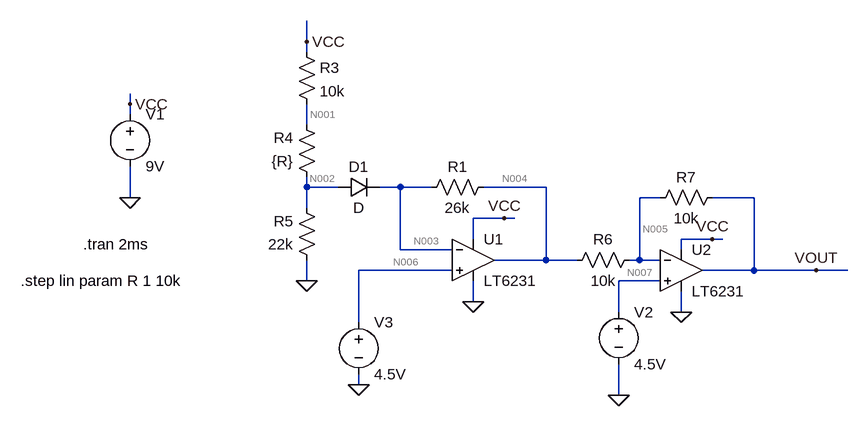
[diagram p0: schematic ExponentialSource.asc]
ExponentialSource.asc, the LTspice schematic file:
Version 4
SHEET 1 880 680
WIRE -336 16 -336 -16
WIRE -336 32 -336 16
WIRE -608 112 -608 96
WIRE -608 128 -608 112
WIRE -336 144 -336 112
WIRE -336 240 -336 224
WIRE -288 240 -336 240
WIRE -192 240 -224 240
WIRE -144 240 -192 240
WIRE 32 240 -64 240
WIRE -608 256 -608 208
WIRE 208 256 176 256
WIRE 352 256 288 256
WIRE -336 272 -336 240
WIRE -32 288 -80 288
WIRE -16 288 -32 288
WIRE 32 288 32 240
WIRE -80 320 -80 288
WIRE 288 320 240 320
WIRE 304 320 288 320
WIRE -192 336 -192 240
WIRE -112 336 -192 336
WIRE 240 336 240 320
WIRE 32 352 32 288
WIRE 32 352 -48 352
WIRE 80 352 32 352
WIRE 176 352 176 256
WIRE 176 352 160 352
WIRE 208 352 176 352
WIRE -112 368 -256 368
WIRE 352 368 352 256
WIRE 352 368 272 368
WIRE 448 368 352 368
WIRE 496 368 448 368
WIRE -336 384 -336 352
WIRE 208 384 144 384
WIRE -80 416 -80 384
WIRE 144 432 144 384
WIRE 240 432 240 400
WIRE -256 448 -256 368
WIRE -256 544 -256 528
WIRE 144 560 144 512
FLAG -608 256 0
FLAG -80 416 0
FLAG -256 544 0
FLAG -336 384 0
FLAG 240 432 0
FLAG -32 288 VCC
FLAG -608 112 VCC
FLAG 288 320 VCC
FLAG -336 16 VCC
FLAG 448 368 VOUT
FLAG 144 560 0
DATAFLAG 32 288 ""
SYMBOL voltage -608 112 R0
WINDOW 123 0 0 Left 2
WINDOW 39 0 0 Left 2
SYMATTR InstName V1
SYMATTR Value 9V
SYMBOL Opamps\\LT6231 -80 352 R0
SYMATTR InstName U1
SYMBOL res -48 224 R90
WINDOW 0 0 56 VBottom 2
WINDOW 3 32 56 VTop 2
SYMATTR InstName R1
SYMATTR Value 26k
SYMBOL voltage -256 432 R0
WINDOW 123 0 0 Left 2
WINDOW 39 0 0 Left 2
SYMATTR InstName V3
SYMATTR Value 4.5V
SYMBOL diode -288 256 R270
WINDOW 0 32 32 VTop 2
WINDOW 3 0 32 VBottom 2
SYMATTR InstName D1
SYMBOL res -320 240 R180
WINDOW 0 36 76 Left 2
WINDOW 3 36 40 Left 2
SYMATTR InstName R4
SYMATTR Value {R}
SYMBOL res -320 368 R180
WINDOW 0 36 76 Left 2
WINDOW 3 36 40 Left 2
SYMATTR InstName R5
SYMATTR Value 22k
SYMBOL res -352 16 R0
SYMATTR InstName R3
SYMATTR Value 10k
SYMBOL Opamps\\LT6231 240 368 R0
SYMATTR InstName U2
SYMBOL res 176 336 R90
WINDOW 0 0 56 VBottom 2
WINDOW 3 32 56 VTop 2
SYMATTR InstName R6
SYMATTR Value 10k
SYMBOL res 304 240 R90
WINDOW 0 0 56 VBottom 2
WINDOW 3 32 56 VTop 2
SYMATTR InstName R7
SYMATTR Value 10k
SYMBOL voltage 144 416 R0
WINDOW 123 0 0 Left 2
WINDOW 39 0 0 Left 2
SYMATTR InstName V2
SYMATTR Value 4.5V
TEXT -680 328 Left 2 !.tran 2ms
TEXT -776 384 Left 2 !.step lin param R 1 10k

The netlist it stands for:
* ExponentialSource.asc
V1 VCC 0 9V
XU1 N006 N003 N004 VCC 0 LT6231  ; pins In+ In- OUT V+ V-
R1 N004 N003 26k
V3 N006 0 4.5V
D1 N002 N003 D
R4 N002 N001 {R}
R5 0 N002 22k
R3 VCC N001 10k
XU2 N007 N005 VOUT VCC 0 LT6231  ; pins In+ In- OUT V+ V-
R6 N005 N004 10k
R7 VOUT N005 10k
V2 N007 0 4.5V
.model D D
.lib standard.dio
.tran 2ms
.step lin param R 1 10k
.lib LTC2.lib
.backanno
.end

* Results of the author's LTspice run, read from the files saved beside the schematic
* Operating Point (first step), zero values left out:
*   r = 1 
*   V(vcc) = 9 V
*   V(n003) = 4.5 V
*   V(n006) = 4.5 V
*   V(n004) = 545.7 mV
*   V(n002) = 5.107 V
*   V(n001) = 5.108 V
*   V(n005) = 4.5 V
*   V(n007) = 4.5 V
*   V(vout) = 8.504 V
*   I(D1) = 157.1 µA
*   I(R7) = 400.4 µA
*   I(R6) = 395.4 µA
*   I(R3) = 389.2 µA
*   I(R5) = -232.1 µA
*   I(R4) = -389.2 µA
*   I(R1) = -152.1 µA
*   I(V2) = -5.002 µA
*   I(V3) = -5.001 µA
*   I(V1) = -6.579 mA
*   Ix(u1:1) = 5.001 µA
*   Ix(u1:2) = 5.001 µA
*   Ix(u1:3) = 547.5 µA
*   Ix(u1:4) = 2.859 mA
*   Ix(u1:5) = -3.417 mA
*   Ix(u2:1) = 5.002 µA
*   Ix(u2:2) = 4.999 µA
*   Ix(u2:3) = -400.4 µA
*   Ix(u2:4) = 3.33 mA
*   Ix(u2:5) = -2.94 mA
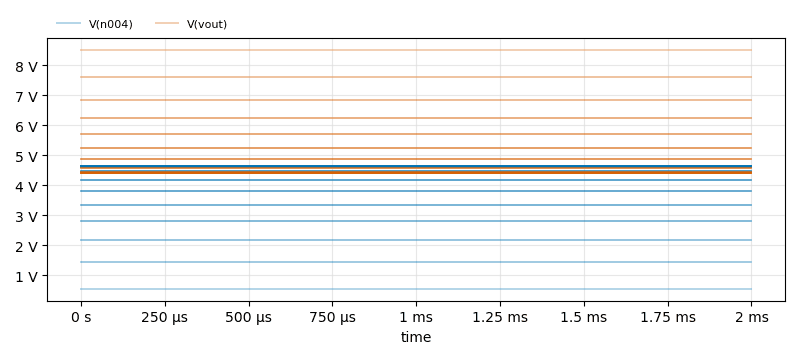
[diagram p1: Transient Analysis of ExponentialSource.asc, plotted from the saved traces]
* Transient Analysis, 21 runs:
*   V(n004) [run 1]: min 545.7 mV, max 545.7 mV, average 545.7 mV, rms 545.7 mV, last 545.7 mV
*   V(n004) [run 2]: 1.443 V at time=0 s, 1.443 V at time=0 s, min 1.443 V, max 1.443 V
*   V(n004) [run 3]: min 1.443 V, max 1.443 V, average 1.443 V, rms 1.443 V, last 1.443 V
*   V(n004) [run 4]: min 2.188 V, max 2.188 V, average 2.188 V, rms 2.188 V, last 2.188 V
*   V(n004) [run 5]: 2.814 V at time=0 s, 2.814 V at time=0 s, min 2.814 V, max 2.814 V
*   V(n004) [run 6]: min 2.814 V, max 2.814 V, average 2.814 V, rms 2.814 V, last 2.814 V
*   V(n004) [run 7]: min 3.346 V, max 3.346 V, average 3.346 V, rms 3.346 V, last 3.346 V
*   V(n004) [run 8]: 3.799 V at time=0 s, 3.799 V at time=0 s, min 3.799 V, max 3.799 V
*   V(vout) [run 1]: min 8.504 V, max 8.504 V, average 8.504 V, rms 8.504 V, last 8.504 V
*   V(vout) [run 2]: 7.607 V at time=0 s, 7.607 V at time=0 s, min 7.607 V, max 7.607 V
*   V(vout) [run 3]: min 7.607 V, max 7.607 V, average 7.607 V, rms 7.607 V, last 7.607 V
*   V(vout) [run 4]: min 6.862 V, max 6.862 V, average 6.862 V, rms 6.862 V, last 6.862 V
*   V(vout) [run 5]: 6.236 V at time=0 s, 6.236 V at time=0 s, min 6.236 V, max 6.236 V
*   V(vout) [run 6]: min 6.236 V, max 6.236 V, average 6.236 V, rms 6.236 V, last 6.236 V
*   V(vout) [run 7]: min 5.704 V, max 5.704 V, average 5.704 V, rms 5.704 V, last 5.704 V
*   V(vout) [run 8]: 5.251 V at time=0 s, 5.251 V at time=0 s, min 5.251 V, max 5.251 V